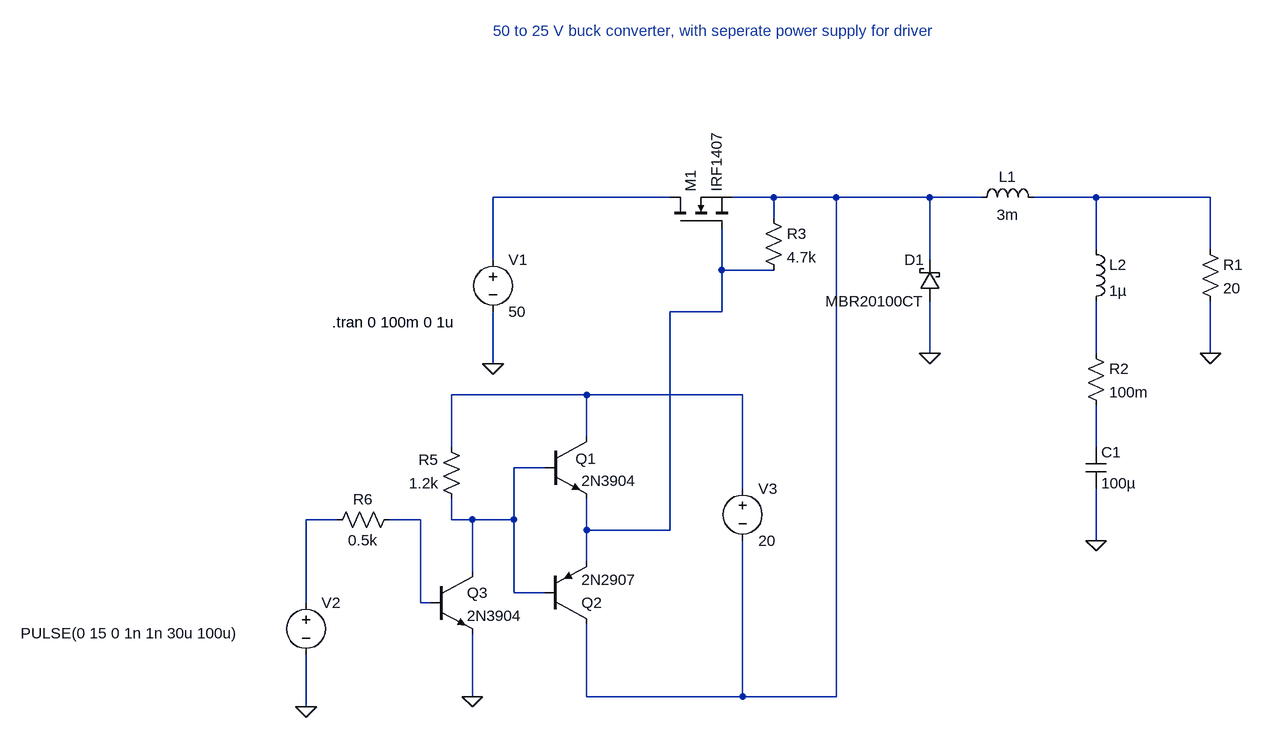
[diagram p0: schematic buck_converter-power-supply-driver.asc]
buck_converter-power-supply-driver.asc, the LTspice schematic file:
Version 4
SHEET 1 1340 916
WIRE -208 32 -480 32
WIRE -48 32 -112 32
WIRE 48 32 -48 32
WIRE 192 32 48 32
WIRE 272 32 192 32
WIRE 448 32 352 32
WIRE 624 32 448 32
WIRE -48 64 -48 32
WIRE 448 112 448 32
WIRE 624 112 624 32
WIRE -480 128 -480 32
WIRE 192 128 192 32
WIRE -128 144 -128 80
WIRE -48 144 -128 144
WIRE -128 208 -128 144
WIRE -128 208 -208 208
WIRE 192 272 192 192
WIRE 448 272 448 192
WIRE 624 272 624 192
WIRE -480 288 -480 208
WIRE -336 336 -544 336
WIRE -96 336 -336 336
WIRE -336 400 -336 336
WIRE -544 416 -544 336
WIRE 448 416 448 352
WIRE -400 448 -448 448
WIRE -96 480 -96 336
WIRE -720 528 -768 528
WIRE -592 528 -640 528
WIRE -544 528 -544 496
WIRE -512 528 -544 528
WIRE -448 528 -448 448
WIRE -448 528 -512 528
WIRE -336 544 -336 496
WIRE -208 544 -208 208
WIRE -208 544 -336 544
WIRE 448 560 448 480
WIRE -336 592 -336 544
WIRE -512 608 -512 528
WIRE -448 640 -448 528
WIRE -400 640 -448 640
WIRE -768 656 -768 528
WIRE -592 656 -592 528
WIRE -576 656 -592 656
WIRE -512 800 -512 704
WIRE -336 800 -336 688
WIRE -96 800 -96 560
WIRE -96 800 -336 800
WIRE 48 800 48 32
WIRE 48 800 -96 800
WIRE -768 816 -768 736
FLAG 192 272 0
FLAG -480 288 0
FLAG 448 560 0
FLAG 624 272 0
FLAG -512 800 0
FLAG -768 816 0
SYMBOL voltage -480 112 R0
WINDOW 123 0 0 Left 0
WINDOW 39 0 0 Left 0
SYMATTR InstName V1
SYMATTR Value 50
SYMBOL nmos -208 80 R270
SYMATTR InstName M1
SYMATTR Value IRF1407
SYMBOL ind 256 48 R270
WINDOW 0 32 56 VTop 2
WINDOW 3 5 56 VBottom 2
SYMATTR InstName L1
SYMATTR Value 3m
SYMBOL schottky 208 192 R180
WINDOW 0 24 64 Left 2
WINDOW 3 24 0 Left 2
SYMATTR InstName D1
SYMATTR Value MBR20100CT
SYMATTR Description Diode
SYMATTR Type diode
SYMBOL cap 432 416 R0
SYMATTR InstName C1
SYMATTR Value 100µ
SYMBOL res 608 96 R0
SYMATTR InstName R1
SYMATTR Value 20
SYMBOL res 432 256 R0
SYMATTR InstName R2
SYMATTR Value 100m
SYMBOL ind 432 96 R0
SYMATTR InstName L2
SYMATTR Value 1µ
SYMBOL voltage -768 640 R0
WINDOW 3 -439 63 Left 2
WINDOW 123 0 0 Left 0
WINDOW 39 0 0 Left 0
SYMATTR Value PULSE(0 15 0 1n 1n 30u 100u)
SYMATTR InstName V2
SYMBOL res -64 48 R0
SYMATTR InstName R3
SYMATTR Value 4.7k
SYMBOL npn -400 400 R0
WINDOW 0 47 34 Left 2
SYMATTR InstName Q1
SYMATTR Value 2N3904
SYMBOL res -528 512 R180
WINDOW 0 36 76 Left 2
WINDOW 3 36 40 Left 2
SYMATTR InstName R5
SYMATTR Value 1.2k
SYMBOL pnp -400 688 M180
SYMATTR InstName Q2
SYMATTR Value 2N2907
SYMBOL res -624 512 R90
WINDOW 0 0 56 VBottom 2
WINDOW 3 32 56 VTop 2
SYMATTR InstName R6
SYMATTR Value 0.5k
SYMBOL npn -576 608 R0
SYMATTR InstName Q3
SYMATTR Value 2N3904
SYMBOL voltage -96 464 R0
WINDOW 123 0 0 Left 0
WINDOW 39 0 0 Left 0
SYMATTR InstName V3
SYMATTR Value 20
TEXT -728 224 Left 2 !.tran 0 100m 0 1u
TEXT -480 -224 Left 2 ;50 to 25 V buck converter, with seperate power supply for driver

The netlist it stands for:
* buck_converter-power-supply-driver.asc
V1 N001 0 50
M1 N001 N004 N002 N002 IRF1407
L1 N002 N003 3m
D1 0 N002 MBR20100CT
C1 N007 0 100µ
R1 N003 0 20
R2 N005 N007 100m
L2 N003 N005 1µ
V2 N009 0 PULSE(0 15 0 1n 1n 30u 100u)
R3 N002 N004 4.7k
Q1 N006 N008 N004 0 2N3904
R5 N008 N006 1.2k
Q2 N002 N008 N004 0 2N2907
R6 N010 N009 0.5k
Q3 N008 N010 0 0 2N3904
V3 N006 N002 20
.model D D
.lib standard.dio
.model NPN NPN
.model PNP PNP
.lib standard.bjt
.model NMOS NMOS
.model PMOS PMOS
.lib standard.mos
.tran 0 100m 0 1u
* 50 to 25 V buck converter, with seperate power supply for driver
.backanno
.end